# Altium schematic sheet ADC.SchDoc
size A4; SheetNumber: 3; SheetTotal: 5
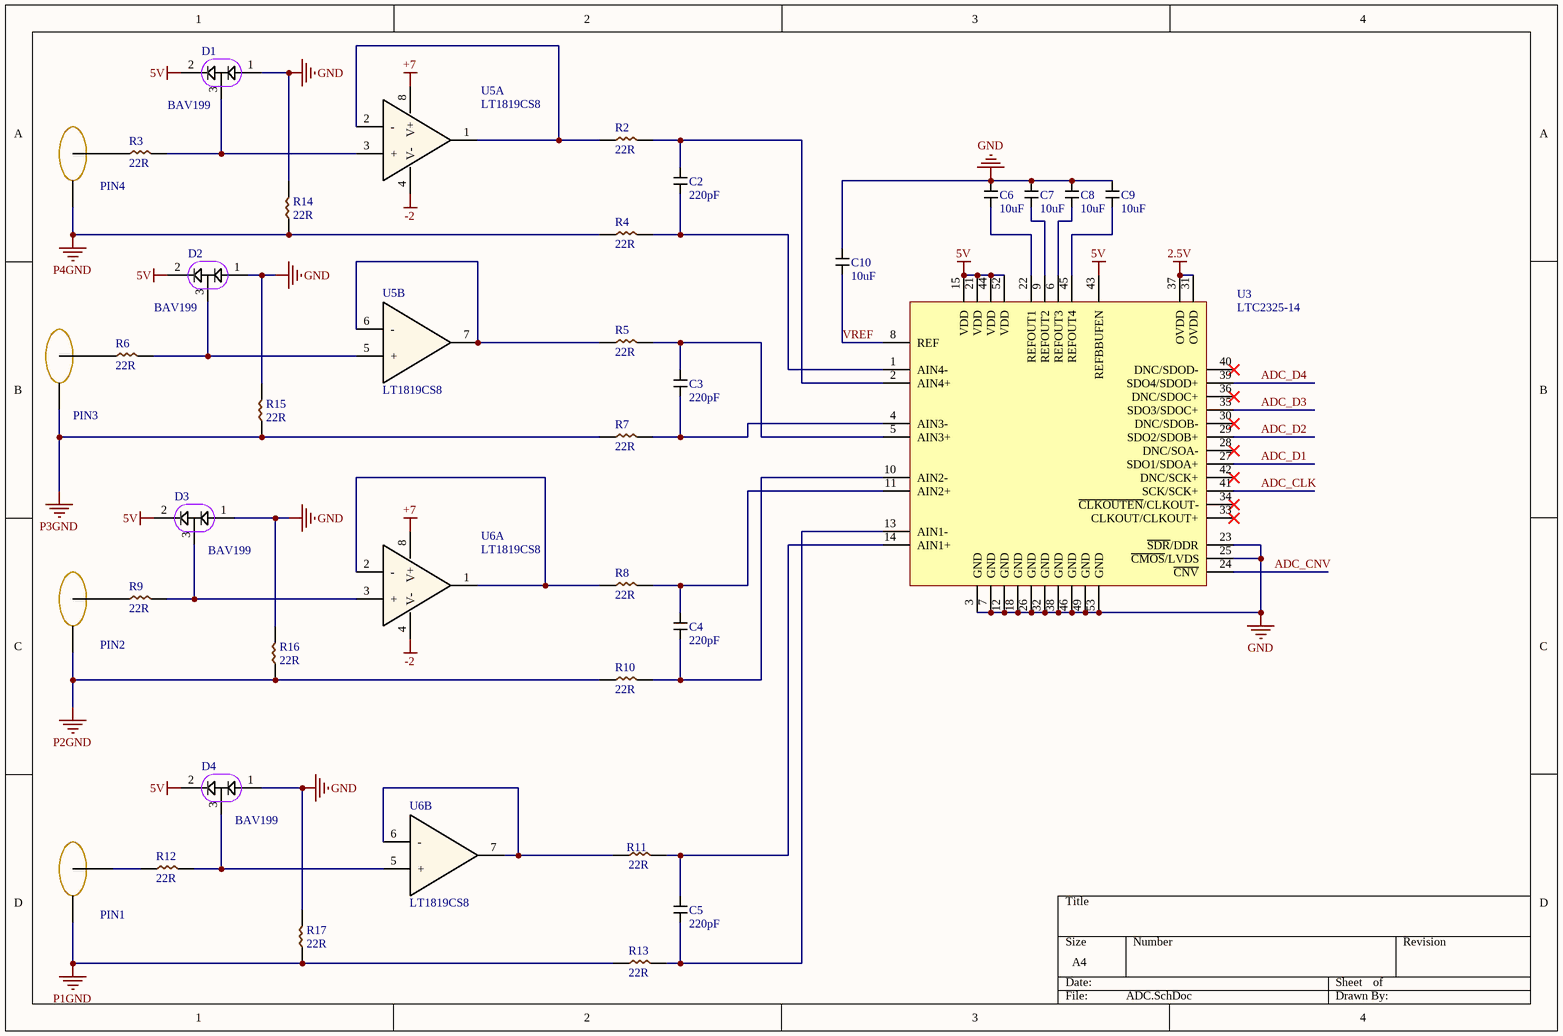
[diagram p0: ADC.SchDoc]

## Parts
C2  220pF  [C0805]
C3  220pF  [C0805]
C4  220pF  [C0805]
C5  220pF  [C0805]
C6  10uF  [C0805]
C7  10uF  [C0805]
C8  10uF  [C0805]
C9  10uF  [C0805]
C10  10uF  [C0805]
D1  BAV199  [SOT23-3]
D2  BAV199  [SOT23-3]
D3  BAV199  [SOT23-3]
D4  BAV199  [SOT23-3]
PIN1  PCB.SMAFRA.HT  [PCB.SMAFRA.HT]  (value not drawn)
PIN2  PCB.SMAFRA.HT  [PCB.SMAFRA.HT]  (value not drawn)
PIN3  PCB.SMAFRA.HT  [PCB.SMAFRA.HT]  (value not drawn)
PIN4  PCB.SMAFRA.HT  [PCB.SMAFRA.HT]  (value not drawn)
R2  22R  [R0805]
R3  22R  [R0805]
R4  22R  [R0805]
R5  22R  [R0805]
R6  22R  [R0805]
R7  22R  [R0805]
R8  22R  [R0805]
R9  22R  [R0805]
R10  22R  [R0805]
R11  22R  [R0805]
R12  22R  [R0805]
R13  22R  [R0805]
R14  22R  [R0805]
R15  22R  [R0805]
R16  22R  [R0805]
R17  22R  [R0805]
U3  LTC2325-14  [QFN-52]
U5  LT1819CS8  [SOIC-8]  (parts A,B of 2)
U6  LT1819CS8  [SOIC-8]  (parts A,B of 2)

## Nets
2.5V: U3.31(OVDD) U3.37(OVDD)
5V: D1.2 D2.2 D3.2 D4.2 U3.15(VDD) U3.21(VDD) U3.43(REFBBUFEN) U3.44(VDD) U3.52(VDD)
+7: U5.8(V+) U6.8(V+)
-2: U5.4(V-) U6.4(V-)
GND: C6.2 C7.2 C8.2 C9.2 C10.2 D1.1 D2.1 D3.1 D4.1 R14.2 R15.2 R16.2 R17.2 U3.3(GND) U3.7(GND) U3.12(GND) U3.18(GND) U3.23(~{SDR}/DDR) U3.25(~{CMOS}/LVDS) U3.26(GND) U3.32(GND) U3.38(GND) U3.46(GND) U3.49(GND) U3.53(GND)
P1GND: PIN1.S R13.1 R17.1
P2GND: PIN2.S R10.1 R16.1
P3GND: PIN3.S R7.1 R15.1
P4GND: PIN4.S R4.1 R14.1
ADC_CLK: U3.41(SCK/SCK+)
ADC_CNV: U3.24(~{CNV})
ADC_D1: U3.27(SDO1/SDOA+)
ADC_D2: U3.29(SDO2/SDOB+)
ADC_D3: U3.35(SDO3/SDOC+)
ADC_D4: U3.39(SDO4/SDOD+)
VREF: C10.1 U3.8(REF)
NetC2_1: C2.1 R4.2 U3.1(AIN4-)
NetC2_2: C2.2 R2.2 U3.2(AIN4+)
NetC3_1: C3.1 R7.2 U3.4(AIN3-)
NetC3_2: C3.2 R5.2 U3.5(AIN3+)
NetC4_1: C4.1 R10.2 U3.10(AIN2-)
NetC4_2: C4.2 R8.2 U3.11(AIN2+)
NetC5_1: C5.1 R13.2 U3.13(AIN1-)
NetC5_2: C5.2 R11.2 U3.14(AIN1+)
NetC6_1: C6.1 U3.22(REFOUT1)
NetC7_1: C7.1 U3.9(REFOUT2)
NetC8_1: C8.1 U3.6(REFOUT3)
NetC9_1: C9.1 U3.45(REFOUT4)
NetD1_3: D1.3 R3.2 U5.3(+)
NetD2_3: D2.3 R6.2 U5.5(+)
NetD3_3: D3.3 R9.2 U6.3(+)
NetD4_3: D4.3 R12.2 U6.5(+)
NetPIN1_1: PIN1.1 R12.1
NetPIN2_1: PIN2.1 R9.1
NetPIN3_1: PIN3.1 R6.1
NetPIN4_1: PIN4.1 R3.1
NetR2_1: R2.1 U5.1 U5.2(-)
NetR5_1: R5.1 U5.6(-) U5.7
NetR8_1: R8.1 U6.1 U6.2(-)
NetR11_1: R11.1 U6.6(-) U6.7

Not connected (* = marked no-connect by the designer): U3 28(DNC/SOA-)* 30(DNC/SDOB-)* 33(CLKOUT/CLKOUT+)* 34(~{CLKOUTEN}/CLKOUT-)* 36(DNC/SDOC+)* 40(DNC/SDOD-)* 42(DNC/SCK+)*

## Library data of the parts
C2-C10 = C0805
  C2-C5: Capacitance: 220pF
  C6-C10: Capacitance: 10uF
R2-R17 = R0805: Resistance: 22R
U3 = LTC2325-14: Quad, 14-Bit + Sign, 5Msps/Ch / Simultaneous Sampling ADC
D1-D4 = BAV199: Supplier 1: Digi-Key; Supplier 2: Mouser; Supplier Part Number 1: BAV199E6327HTSA1CT-ND; Supplier Part Number 2: 726-BAV199E6327HTSA1
PIN1-PIN4 = PCB.SMAFRA.HT: Supplier 1: Digi-Key; Supplier 2: Mouser; Supplier Part Number 2: 960-PCB.SMAFRA.HT; Supplier Part Number 1: 931-1361-ND
U5 U6 = LT1819CS8: Supplier 1: Digi-Key; Supplier Part Number 1: LT1819CS8#TRPBFCT-ND